# EAGLE design vfd_controller_com (EAGLE 9.6.1)
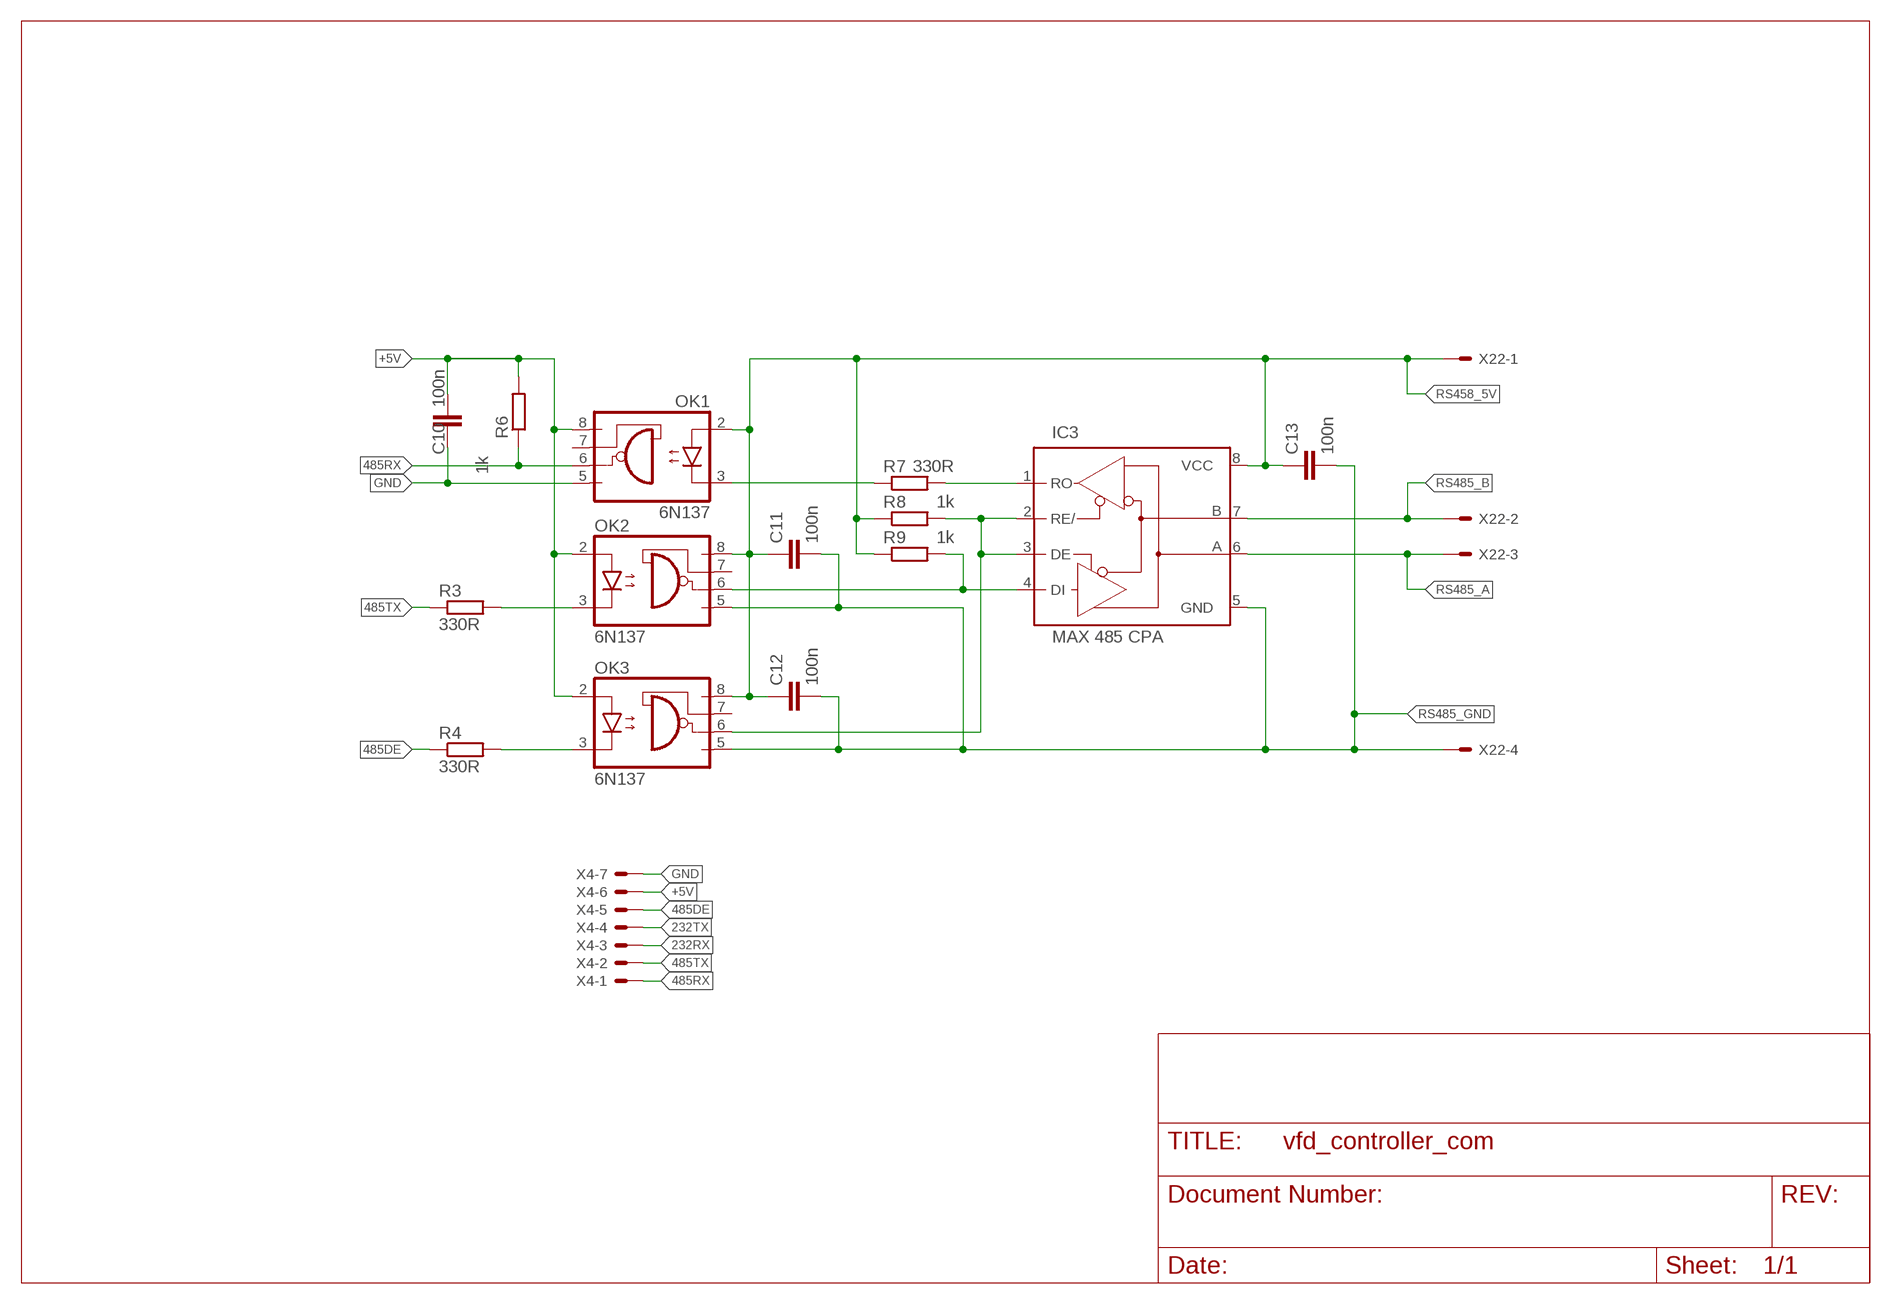
[diagram p0: schematic, sheet 1]

## Parts
C10  100n  C-EU025-024X044  [C025-024X044]
C11  100n  C-EU025-024X044  [C025-024X044]
C12  100n  C-EU025-024X044  [C025-024X044]
C13  100n  C-EU025-024X044  [C025-024X044]
IC3  MAX 485 CPA  MAX3468CPA  [DIL08]
OK1  6N137  [DIL08]
OK2  6N137  [DIL08]
OK3  6N137  [DIL08]
R3  330R  R-EU_0204/7  [0204/7]
R4  330R  R-EU_0204/7  [0204/7]
R6  1k  R-EU_0204/7  [0204/7]
R7  330R  R-EU_0204/7  [0204/7]
R8  1k  R-EU_0204/7  [0204/7]
R9  1k  R-EU_0204/7  [0204/7]
X4  JST-XH-07-PIN-LONG-PAD  [JST-XH-07-PACKAGE-LONG-PAD]
X22  JST-XH-04-PIN-LONG-PAD  [JST-XH-04-PACKAGE-LONG-PAD]

## Nets
232RX: X4.3
232TX: X4.4
485DE: R4.1 X4.5
485RX: OK1.6(VO) R6.1 X4.1
485TX: R3.1 X4.2
+5V: C10.2 OK1.8(VCC) OK2.2(A) OK3.2(A) R6.2 X4.6
GND: C10.1 OK1.5(GND) X4.7
N$6: IC3.2(RE/) IC3.3(DE) OK3.6(VO) R8.2
N$8: IC3.1(RO) R7.2
N$9: OK1.3(C) R7.1
N$10: IC3.4(DI) OK2.6(VO) R9.2
N$11: OK3.3(C) R4.2
N$12: OK2.3(C) R3.2
RS458_5V: C11.1 C12.1 C13.1 IC3.8(VCC) OK1.2(A) OK2.8(VCC) OK3.8(VCC) R8.1 R9.1 X22.1
RS485_A: IC3.6(A) X22.3
RS485_B: IC3.7(B) X22.2
RS485_GND: C11.2 C12.2 C13.2 IC3.5(GND) OK2.5(GND) OK3.5(GND) X22.4
Unconnected: OK1.7(VE) OK2.7(VE) OK3.7(VE)

## Library data of the parts
C10-C13 = resistor:C-EU: CAPACITOR, European symbol; R: MKS02-63 100N
IC3 = maxim:MAX34*: +5V, Fail-Safe, 40Mbps, Profibus RS-485/RS-422 Transceivers Source: MAX3465-MAX3469.pdf; OC_FARNELL: unknown; OC_NEWARK: unknown; R: MAX 485 CPA
OK1-OK3 = optocoupler:6N137: MOTOROLA OPTO COUPLER; MPN: 6N137; OC_FARNELL: 1328376; OC_NEWARK: 52M1895; R: 6N 137
R3 R4 R7 = resistor:R-EU_: RESISTOR, European symbol; R: METALL 330
R6 R8 R9 = resistor:R-EU_: RESISTOR, European symbol; R: METALL 1,00K
X4 =  JST_XH_connnectors:JST-XH-07-PIN: JST XH Connector 2 Pin Wire to board connector. Pitch: 2,54 mm, (0.100") Number of pins: 7 Created by Rembrandt Electronics www.rembrandtelectronics.com
X22 =  JST_XH_connnectors:JST-XH-04-PIN: JST XH Connector 2 Pin Wire to board connector. Pitch: 2,54 mm, (0.100") Number of pins: 4 Created by Rembrandt Electronics www.rembrandtelectronics.com

## Board
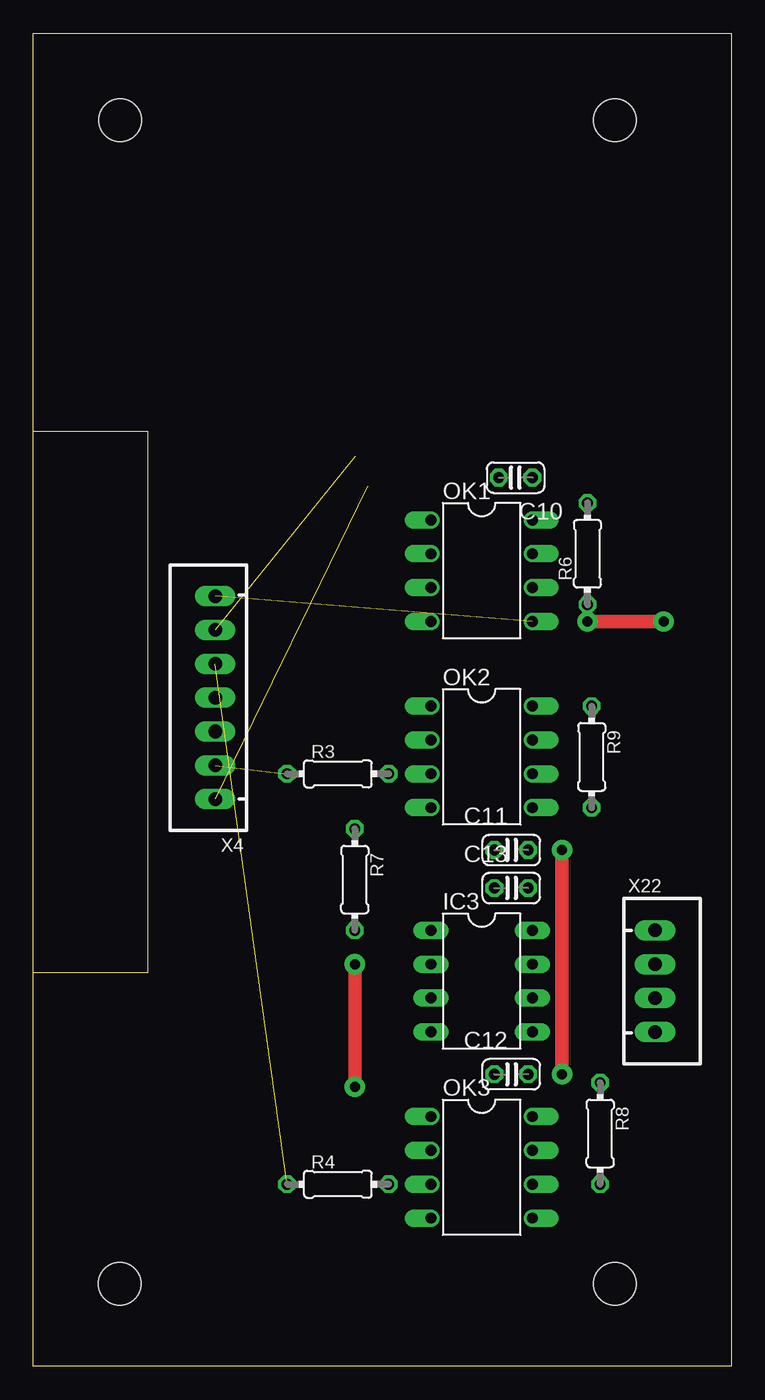
[diagram p1: board, top side]
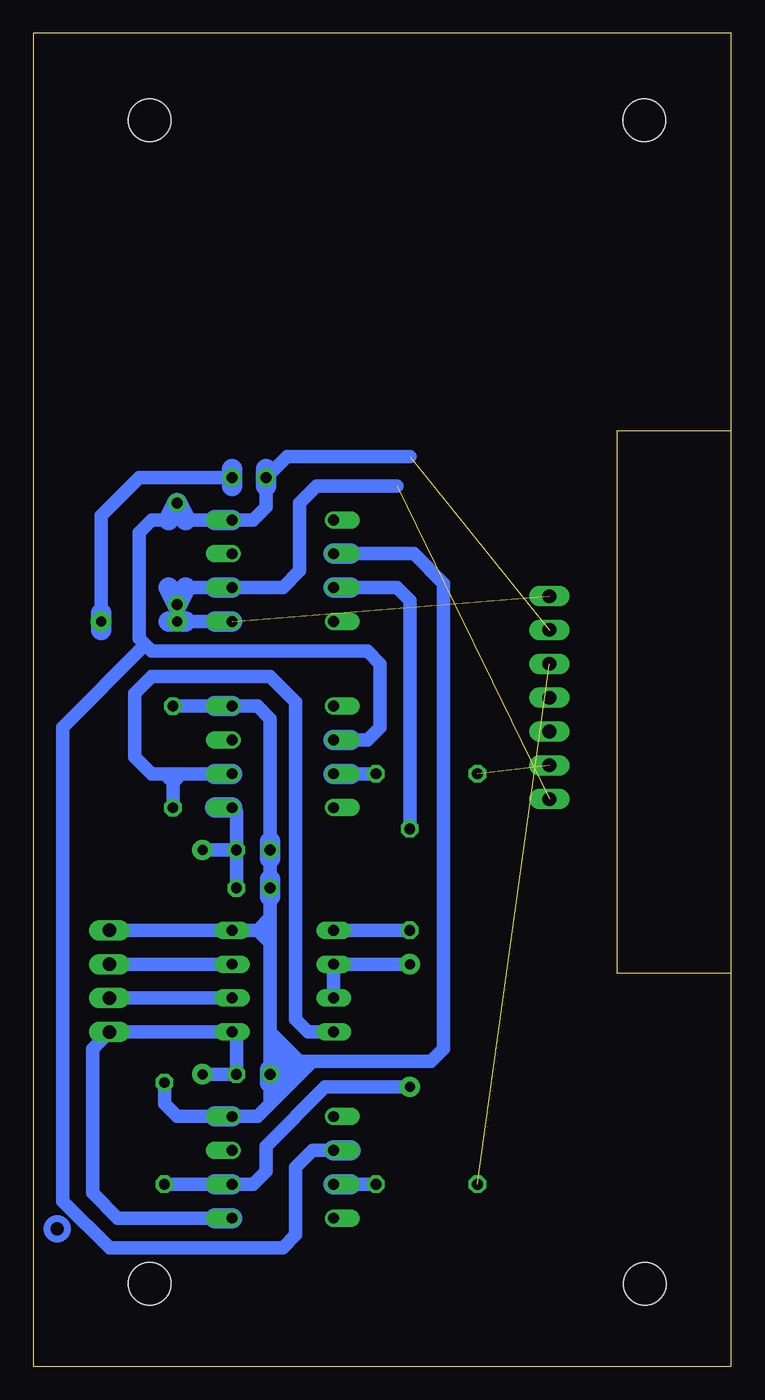
[diagram p2: board, bottom side, seen from below]

Size 52.39 x 100.01 mm. Coordinates in mm from the lower left corner, seen from the top.
Outline: 0,29.53 0,0 52.39,0 52.39,100.01 0,100.01 0,70.17
Outline: 0,29.53 0,70.17
Outline: 0,70.17 8.57,70.17 8.57,29.53 0,29.53
Copper layers (1*16): Top 0.035mm / dielectric 1.5mm / Bottom 0.035mm
Design rules "default": minimum track width 6mil, minimum drill 0.35mm, track to track 6mil, track to pad 6mil, pad to pad 6mil, via to via 6mil, smd to smd 6mil, copper to edge 40mil, drill to drill 6mil, minimum pad ring 10mil, minimum via ring 8mil, stop-mask expansion 4mil, vias tented up to drill 0mil, thermal gap 10mil
Holes 3.2 mm at 6.51,93.51 43.66,93.51 6.5,6.2 43.64,6.19

### Footprints (pad centres in the part's own frame; a part is rotated, then mirrored left to right if it is on the bottom)
C025-024X044 = drill 0.813 octagon: 1 -1.27,0; 2 1.27,0
DIL08 = drill 0.813 long: 1 -3.81,-3.81; 2 -1.27,-3.81; 3 1.27,-3.81; 4 3.81,-3.81; 5 3.81,3.81; 6 1.27,3.81; 7 -1.27,3.81; 8 -3.81,3.81
DIL08' = drill 0.813 offset: 1 -3.81,-3.81; 2 -1.27,-3.81; 3 1.27,-3.81; 4 3.81,-3.81; 5 3.81,3.81; 6 1.27,3.81; 7 -1.27,3.81; 8 -3.81,3.81
0204/7 = drill 0.813 octagon: 1 -3.81,0; 2 3.81,0
JST-XH-07-PACKAGE-LONG-PAD = drill 1.016 long: 1 -7.62,0; 2 -5.08,0; 3 -2.54,0; 4 0,0; 5 2.54,0; 6 5.08,0; 7 7.62,0
JST-XH-04-PACKAGE-LONG-PAD = drill 1.016 long: 1 -3.81,0; 2 -1.27,0; 3 1.27,0; 4 3.81,0

### Placement (x,y rotation side)
C10  36.19,66.67 180 top
C11  35.88,38.73 0 top
C12  35.88,21.91 0 top
C13  35.88,35.88 0 top
IC3  33.66,28.89 270 top
OK1  6N137  [DIL08']  33.66,59.69 270 top
OK2  6N137  [DIL08']  33.66,45.72 270 top
OK3  6N137  [DIL08']  33.66,14.92 270 top
R3  22.86,44.45 0 top
R4  22.86,13.65 0 top
R6  41.59,60.96 90 top
R7  24.13,36.51 270 top
R8  42.54,17.46 270 top
R9  41.91,45.72 270 top
U$1  [A4L-LOC]  -105.09,-45.72 0 top  (outside the outline)
X4  13.65,50.17 90 top
X22  46.67,28.89 270 top

### Tracks (layer width: path | path; a pad name or v marks a point on that pad's centre or on a via)
485DE  (1 unrouted)
485RX  (1 unrouted)
  Bottom 1: 38.73,58.42 40.96,58.42 | OK1.6 33.66,58.42 32.38,59.69 32.38,64.77 31.12,66.04 25.08,66.04
  Bottom 1.524: 40.96,58.42 R6.1 42.23,58.42 | OK1.6 38.73,58.42
485TX  (1 unrouted)
+5V  (1 unrouted)
  Bottom 1: 38.73,63.5 40.96,63.5 | 28.57,46.99 27.31,46.99 26.35,47.94 26.35,52.7 27.31,53.66 43.5,53.66 43.97,54.13 44.45,54.61 44.45,62.55 43.5,63.5 42.23,63.5 | 34.93,66.04 34.93,64.45 35.88,63.5 OK1.8 | OK3.2 31.43,16.19 32.7,14.92 32.7,9.84 | C10.2 33.34,68.26 24.13,68.26
  Bottom 1.016: 32.7,9.84 33.66,8.89 46.67,8.89 50.16,12.38 50.16,47.94 43.97,54.13
  Bottom 1.524: 34.93,66.04 C10.2 34.93,67.31 | 40.96,63.5 R6.2 42.23,63.5 | OK1.8 38.73,63.5 | OK3.2 28.57,16.19 | OK2.2 28.57,46.99
GND  (via drill 0.75 pad 1.52)  (1 unrouted)
  Top 1: v41.59,55.88 v47.31,55.88
  Bottom 1: 40.96,55.88 38.73,55.88 | 47.31,56.52 47.31,63.82 44.45,66.67 C10.1
  Bottom 1.524: 37.47,66.04 C10.1 37.47,67.31 | OK1.5 38.73,55.88 | 40.96,55.88 v41.59,55.88 42.23,55.88 | 47.31,56.52 v47.31,55.88 47.31,55.25
N$6  (via drill 0.75 pad 1.52)
  Top 1: v24.13,30.16 v24.13,20.95
  Bottom 1: IC3.3 IC3.2 v24.13,30.16 | OK3.6 35.88,13.65 34.93,14.61 34.93,16.51 30.48,20.95 v24.13,20.95
  Bottom 1.016: OK3.6 R8.2
  Bottom 1.524: OK3.6 38.73,13.65
N$8
  Bottom 1.016: R7.2 IC3.1
N$9
  Bottom 1: R7.1 24.13,57.47 25.08,58.42 28.57,58.42
  Bottom 1.524: OK1.3 28.57,58.42
N$10
  Bottom 1: IC3.4 31.75,25.08 32.7,26.03 32.7,49.85 34.61,51.75 43.5,51.75 44.77,50.48 44.77,45.72 43.5,44.45 42.54,44.45 | 38.73,44.45 41.28,44.45
  Bottom 1.016: R9.2 41.91,43.81 | 41.91,43.81 41.28,44.45 42.54,44.45 41.91,43.81
  Bottom 1.524: OK2.6 38.73,44.45
N$11
  Bottom 1.016: R4.2 OK3.3
  Bottom 1.524: OK3.3 28.57,13.65
N$12
  Bottom 1: 29.21,44.45 OK2.3
  Bottom 1.016: R3.2 OK2.3
  Bottom 1.524: OK2.3 28.57,44.45
RS458_5V
  Bottom 1: 35.56,32.7 34.93,32.7 | 34.61,19.69 34.61,21.27 | 34.61,21.27 34.61,22.22 34.61,24.45 | 34.61,24.45 34.61,25.08 | 34.61,25.08 34.61,31.75 | 34.61,31.75 34.61,33.66 | 35.56,32.7 34.61,33.66 | IC3.8 35.56,32.7 | 35.56,32.7 34.61,31.75 | OK3.8 35.56,18.73 34.61,19.69 | 41.28,49.53 38.73,49.53 | OK2.8 35.56,49.53 34.61,48.58 34.61,39.37 | 34.61,22.86 33.02,22.86 | 33.02,22.86 32.38,22.86 | 32.38,22.86 31.43,22.86 | 33.02,22.86 34.61,21.27 | 33.02,22.86 34.61,24.45 | 34.61,25.08 32.38,22.86 | 34.61,19.69 34.13,20.16 | 34.13,20.16 31.43,22.86 | 34.13,20.16 34.13,21.11 32.38,22.86 | 28.57,60.96 23.81,60.96 21.59,58.74 21.59,23.81 22.54,22.86 31.43,22.86 | 34.61,35.24 34.61,33.66 | 34.61,36.51 34.61,38.1
  Bottom 1.016: IC3.8 X22.1 | R9.1 41.28,49.53 | OK3.8 41.59,18.73 42.54,19.69 R8.1
  Bottom 1.524: OK2.8 38.73,49.53 | 34.61,39.37 C11.1 34.61,38.1 | 34.61,36.51 C13.1 34.61,35.24 | 34.61,22.22 C12.1 34.61,21.27 | OK3.8 38.73,18.73 | OK1.2 28.57,60.96
RS485_A
  Bottom 1.016: IC3.6 X22.3
RS485_B
  Bottom 1.016: IC3.7 X22.2
RS485_GND  (via drill 0.75 pad 1.52)
  Top 1: v39.69,38.73 v39.69,21.91
  Bottom 1: OK3.5 46.04,11.11 47.94,13.02 47.94,21.95
  Bottom 1.016: 47.94,21.95 47.94,23.81 X22.4 IC3.5 37.15,24.77 C12.2 v39.69,21.91 | C13.2 C11.2 | C11.2 v39.69,38.73 | C11.2 37.15,41.59 OK2.5
  Bottom 1.524: OK2.5 38.73,41.91 | OK3.5 38.73,11.11
(copper drawn outside any net)
  shapes: Bottom circle x5

### Text on the board
Document: Variable Frequency Drive | VFD-Conroller COM Board | (C) 2020 Christoph Klie | Version 1.0 | [1/1]